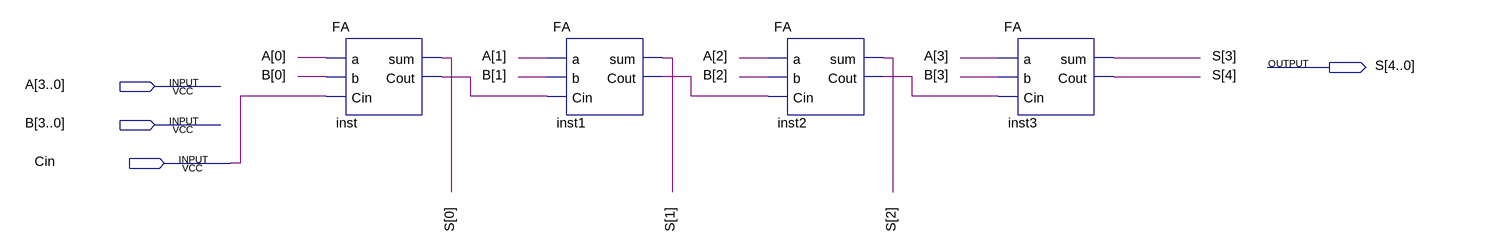
[diagram p0: schematic sheet]
// Quartus schematic 4badder.bdf as structural Verilog: 4 symbols, 4 pins
module \4badder  (
  input  [3:0] A,
  input  [3:0] B,
  input  Cin,
  output [4:0] S
);

  wire inst1_cout, inst2_cout, inst_cout;

  FA inst (.a(A[0]), .b(B[0]), .Cin(Cin), .sum(S[0]), .Cout(inst_cout));
  FA inst1 (.a(A[1]), .b(B[1]), .Cin(inst_cout), .sum(S[1]), .Cout(inst1_cout));
  FA inst2 (.a(A[2]), .b(B[2]), .Cin(inst1_cout), .sum(S[2]), .Cout(inst2_cout));
  FA inst3 (.a(A[3]), .b(B[3]), .Cin(inst2_cout), .sum(S[3]), .Cout(S[4]));
endmodule
